# EAGLE design GPS_Tracker_Base_Station (EAGLE 9.7.0)

## Sheet 1 of 2
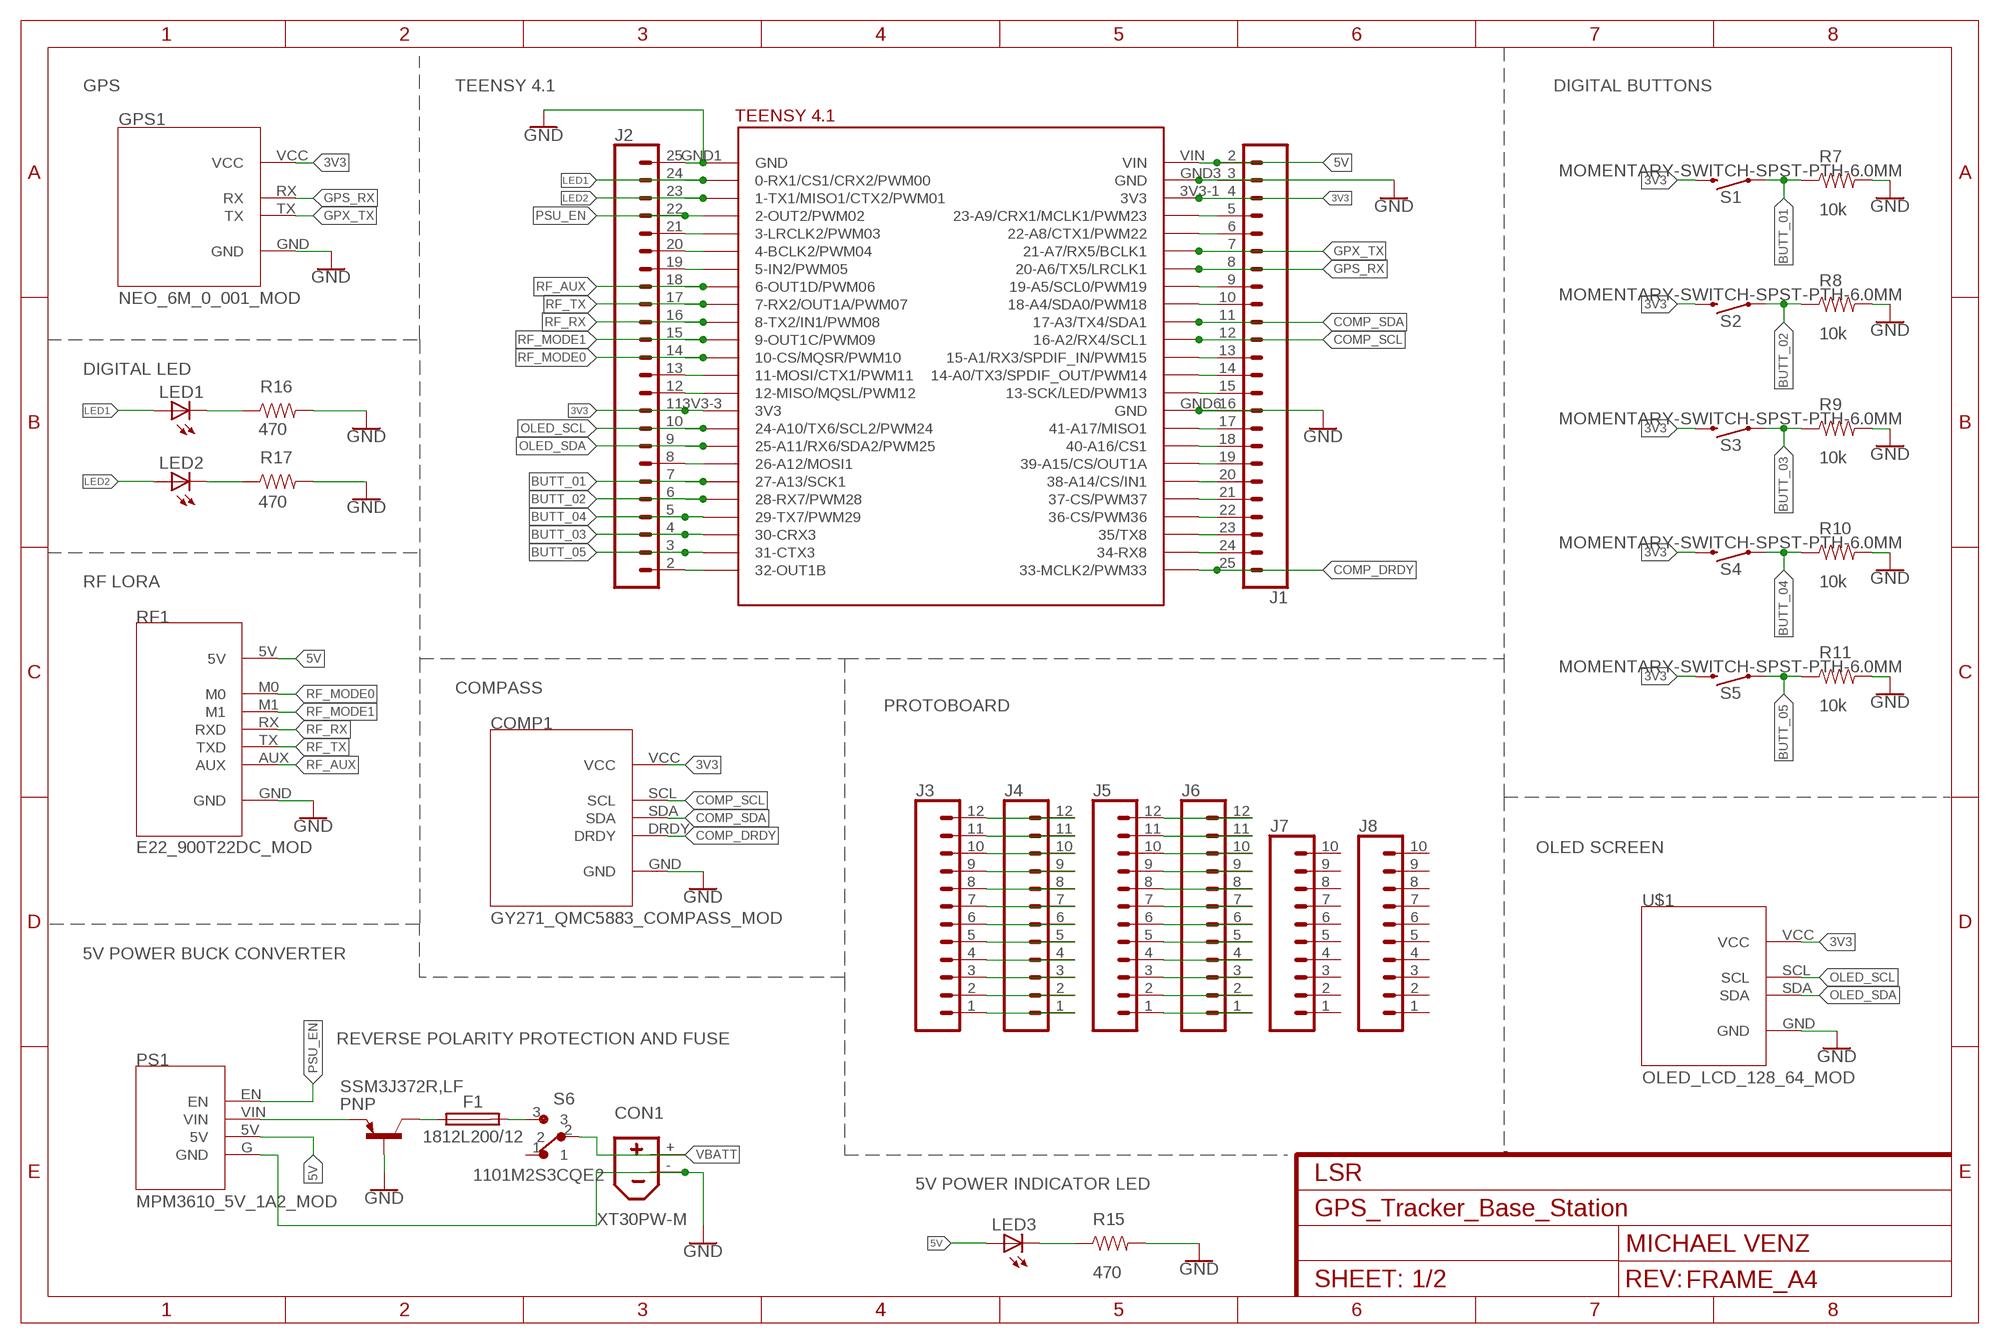
[diagram p0: schematic, sheet 1]

### Parts
COMP1  GY271_QMC5883_COMPASS_MOD  [GY271_QMC5883_COMPASS_MOD_FP]
CON1  XT30PW-M  [XT30PW-PLUG]
F1  1812L200/12  [FUSC4532X125]
GPS1  NEO_6M_0_001_MOD  [NEO_6M_0_001_MOD_FP]
J1  CONN_24  [1X24]
J2  CONN_24  [1X24]
J3  CONN_12NO_SILK  [1X12_NO_SILK]
J4  CONN_12NO_SILK  [1X12_NO_SILK]
J5  CONN_12NO_SILK  [1X12_NO_SILK]
J6  CONN_12NO_SILK  [1X12_NO_SILK]
J7  CONN_10NO_SILK_PTH_FEMALE  [1X10_NO_SILK]
J8  CONN_10NO_SILK_PTH_FEMALE  [1X10_NO_SILK]
LED1  LEDCHIPLED_0805  [CHIPLED_0805]
LED2  LEDCHIPLED_0805  [CHIPLED_0805]
LED3  LEDCHIPLED_0805  [CHIPLED_0805]
PS1  MPM3610_5V_1A2_MOD  [MPM3610_5V_1A2_FP]
R7  10k  0805_RESISTOR  [0805_RESISTOR_FP]
R8  10k  0805_RESISTOR  [0805_RESISTOR_FP]
R9  10k  0805_RESISTOR  [0805_RESISTOR_FP]
R10  10k  0805_RESISTOR  [0805_RESISTOR_FP]
R11  10k  0805_RESISTOR  [0805_RESISTOR_FP]
R15  470  0805_RESISTOR  [0805_RESISTOR_FP]
R16  470  0805_RESISTOR  [0805_RESISTOR_FP]
R17  470  0805_RESISTOR  [0805_RESISTOR_FP]
RF1  E22_900T22DC_MOD  [E22_900T22DC_MOD_FP]
S1  MOMENTARY-SWITCH-SPST-PTH-6.0MM  [TACTILE_SWITCH_PTH_6.0MM]
S2  MOMENTARY-SWITCH-SPST-PTH-6.0MM  [TACTILE_SWITCH_PTH_6.0MM]
S3  MOMENTARY-SWITCH-SPST-PTH-6.0MM  [TACTILE_SWITCH_PTH_6.0MM]
S4  MOMENTARY-SWITCH-SPST-PTH-6.0MM  [TACTILE_SWITCH_PTH_6.0MM]
S5  MOMENTARY-SWITCH-SPST-PTH-6.0MM  [TACTILE_SWITCH_PTH_6.0MM]
S6  1101M2S3CQE2  [SW_1101M2S3CQE2]
SSM3J372R,LF  PNP  PNP_SOT23  [SOT95P237X112-3N]
U$1  OLED_LCD_128_64_MOD  [OLED_LCD_128_64_MOD_FP]
U$3  TEENSY_4_1  [TEENSY_4_1_FP]

### Nets
3V3: COMP1.VCC GPS1.VCC J1.4 J2.11 S1.3 S2.3 S3.3 S4.3 S5.3 U$1.VCC U$3.3V3-1(3V3) U$3.3V3-3(3V3)
5V: J1.2 LED3.A PS1.5V RF1.5V U$3.VIN
BUTT_01: J2.7 R7.1 S1.1 U$3.27-A13/SCK1
BUTT_02: J2.6 R8.1 S2.1 U$3.28-RX7/PWM28
BUTT_03: J2.4 R9.1 S3.1 U$3.30-CRX3
BUTT_04: J2.5 R10.1 S4.1 U$3.29-TX7/PWM29
BUTT_05: J2.3 R11.1 S5.1 U$3.31-CTX3
COMP_DRDY: COMP1.DRDY J1.25 U$3.33-MCLK2/PWM33
COMP_SCL: COMP1.SCL J1.12 U$3.16-A2/RX4/SCL1
COMP_SDA: COMP1.SDA J1.11 U$3.17-A3/TX4/SDA1
GND: COMP1.GND CON1.- GPS1.GND J1.3 J1.16 J2.25 PS1.G(GND) R7.2 R8.2 R9.2 R10.2 R11.2 R15.2 R16.2 R17.2 RF1.GND SSM3J372R,LF.1(B) U$1.GND U$3.GND1(GND) U$3.GND3(GND) U$3.GND6(GND)
GPS_RX: GPS1.RX J1.8 U$3.20-A6/TX5/LRCLK1
GPX_TX: GPS1.TX J1.7 U$3.21-A7/RX5/BCLK1
LED1: J2.24 LED1.A U$3.0-RX1/CS1/CRX2/PWM00
LED2: J2.23 LED2.A U$3.1-TX1/MISO1/CTX2/PWM01
N$1: J1.5 U$3.23-A9/CRX1/MCLK1/PWM23
N$2: J1.6 U$3.22-A8/CTX1/PWM22
N$3: J1.10 U$3.18-A4/SDA0/PWM18
N$4: J1.13 U$3.15-A1/RX3/SPDIF_IN/PWM15
N$5: J3.12 J4.12
N$6: J2.2 U$3.32-OUT1B
N$7: J1.14 U$3.14-A0/TX3/SPDIF_OUT/PWM14
N$8: J1.15 U$3.13-SCK/LED/PWM13
N$9: J1.17 U$3.41-A17/MISO1
N$10: J1.18 U$3.40-A16/CS1
N$11: J1.19 U$3.39-A15/CS/OUT1A
N$12: J1.20 U$3.38-A14/CS/IN1
N$13: J1.21 U$3.37-CS/PWM37
N$14: J1.22 U$3.36-CS/PWM36
N$15: J1.23 U$3.35-TX8(35/TX8)
N$16: J1.24 U$3.34-RX8
N$17: J3.11 J4.11
N$18: J3.10 J4.10
N$19: J1.9 U$3.19-A5/SCL0/PWM19
N$20: J2.21 U$3.3-LRCLK2/PWM03
N$21: J2.20 U$3.4-BCLK2/PWM04
N$22: J2.19 U$3.5-IN2/PWM05
N$23: J2.13 U$3.11-MOSI/CTX1/PWM11
N$24: J2.12 U$3.12-MISO/MQSL/PWM12
N$25: J3.9 J4.9
N$26: J2.8 U$3.26-A12/MOSI1
N$27: J3.8 J4.8
N$29: J3.7 J4.7
N$30: J3.6 J4.6
N$31: J3.5 J4.5
N$33: LED1.C R16.1
N$34: J3.4 J4.4
N$35: J3.3 J4.3
N$36: J3.2 J4.2
N$37: J3.1 J4.1
N$38: J5.12 J6.12
N$39: J5.11 J6.11
N$40: J5.10 J6.10
N$41: J5.9 J6.9
N$42: F1.2 S6.3
N$43: F1.1 SSM3J372R,LF.3(C)
N$44: PS1.VIN SSM3J372R,LF.2(E)
N$45: J5.8 J6.8
N$46: J5.7 J6.7
N$47: J5.6 J6.6
N$48: J5.5 J6.5
N$49: J5.4 J6.4
N$50: J5.3 J6.3
N$51: J5.2 J6.2
N$52: J5.1 J6.1
N$54: LED2.C R17.1
N$55: LED3.C R15.1
OLED_SCL: J2.10 U$1.SCL U$3.24-A10/TX6/SCL2/PWM24
OLED_SDA: J2.9 U$1.SDA U$3.25-A11/RX6/SDA2/PWM25
PSU_EN: J2.22 PS1.EN U$3.2-OUT2/PWM02
RF_AUX: J2.18 RF1.AUX U$3.6-OUT1D/PWM06
RF_MODE0: J2.14 RF1.M0 U$3.10-CS\MQSR/PWM10(10-CS/MQSR/PWM10)
RF_MODE1: J2.15 RF1.M1 U$3.9-OUT1C/PWM09
RF_RX: J2.16 RF1.RX(RXD) U$3.8-TX2/IN1/PWM08
RF_TX: J2.17 RF1.TX(TXD) U$3.7-RX2/OUT1A/PWM07
VBATT: CON1.+ S6.2
Unconnected: J7.1 J7.2 J7.3 J7.4 J7.5 J7.6 J7.7 J7.8 J7.9 J7.10 J8.1 J8.2 J8.3 J8.4 J8.5 J8.6 J8.7 J8.8 J8.9 J8.10 S6.1

### Notes on the sheet
- GPS | TEENSY 4.1 | DIGITAL BUTTONS
- DIGITAL LED
- RF LORA
- COMPASS
- PROTOBOARD
- OLED SCREEN
- 5V POWER BUCK CONVERTER
- REVERSE POLARITY PROTECTION AND FUSE
- 5V POWER INDICATOR LED

## Sheet 2 of 2
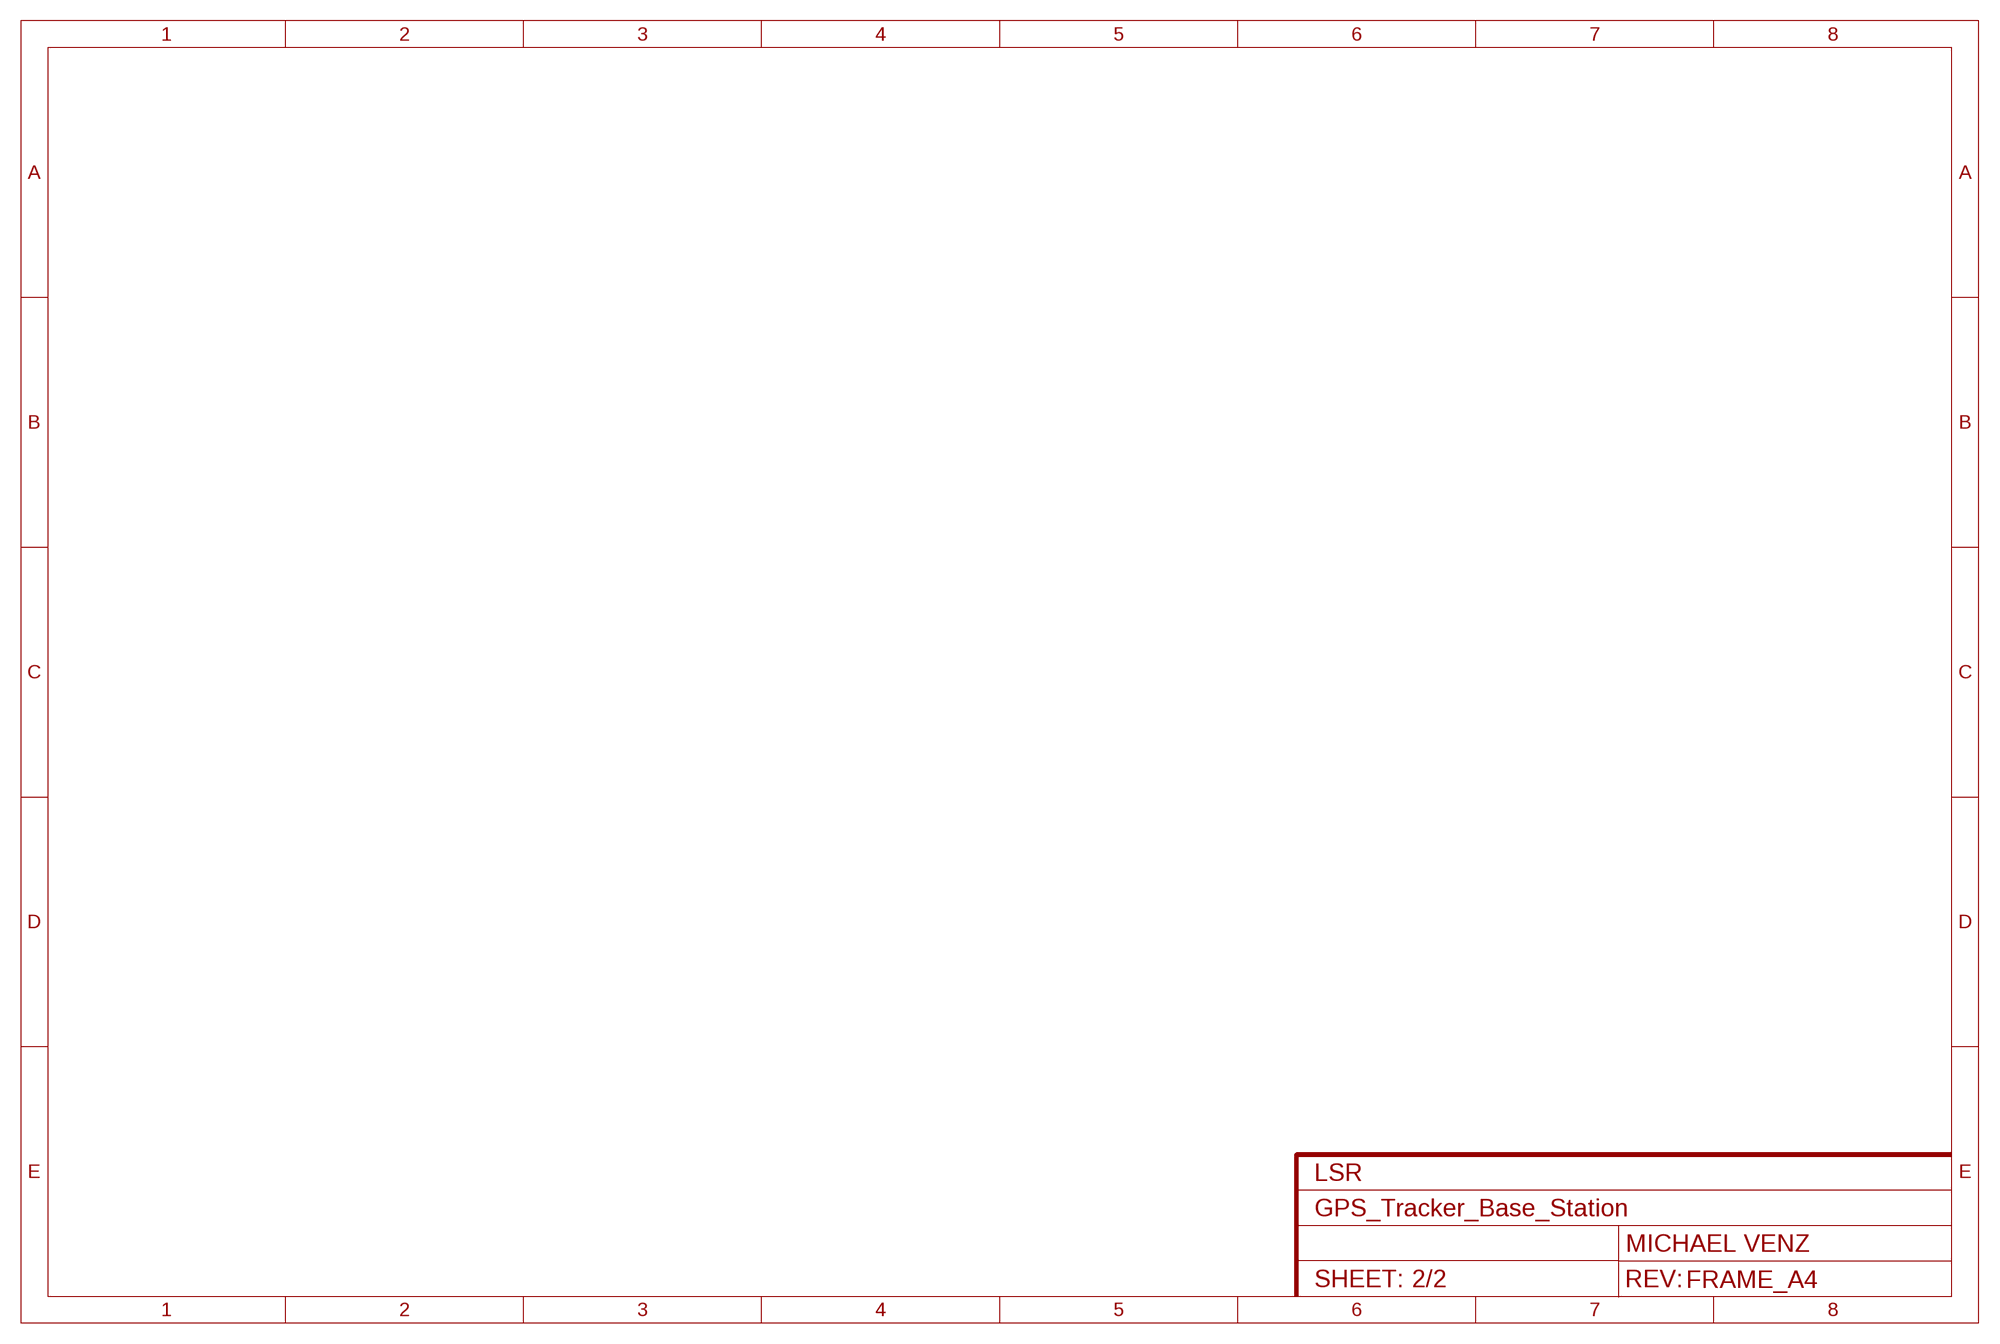
[diagram p1: schematic, sheet 2]

## Library data of the parts
COMP1 = LSR_Modules:GY271_QMC5883_COMPASS_MOD
CON1 = LSR_Connectors:XT30: AMASS XT30 connector Store in Japan AMASS XT30 connector <https://szc.jp/ams-xt30>
F1 = Fuse:1812L: 1812L Series PTC provides surface mount overcurrent protection for applications where resettable protection is desired. Datasheet <https://www.littelfuse.com/~/media/electronics/datasheets/resettable_ptcs/littelfuse_ptc_1812l_datasheet.pdf.pdf>; CATEGORY: FUSE; DESCRIPTION: Resettable PTCs; MANUFACTURER: Littlefuse; MPN: 1812L200/12; OPERATING_TEMPERATURE: -40°C to +85°C; PART_STATUS: ACTIVE; ROHS_COMPLIANCE: RoHS Compliant; SERIES: 1812L; SUBCATEGORY: Resettable; TYPE: PTC
GPS1 = LSR_Modules:NEO_6M_0_001_MOD
J1 J2 = SparkFun-Connectors:CONN_24: Multi connection point. Often used as Generic Header-pin footprint for 0.1 inch spaced/style header connections On any of the 0.1 inch spaced packages, you can populate with these: Break Away Headers - Straight <https://www.sparkfun.com/products/116> (PRT-00116) Break Away Male Headers - Right Angle <https://www.sparkfun.com/products/553> (PRT-00553) Female Headers <https://www.sparkfun.com/products/115> (PRT-00115) Break Away Headers - Machine Pin <https://www.sparkfun.com/products/117> (PRT-00117) Break Away Female Headers - Swiss Machine Pin <https://www.sparkfun.com/products/743> (PRT-00743) For SCREWTERMINALS and SPRING TERMINALS visit here: Screw Terimnals on SparkFun.com <https://www.sparkfun.com/search/results?term=Screw+Terminals> (5mm/3.5mm/2.54mm spacing) This device is also useful as a general connection point to wire up your design to another part of your project. Our various solder wires solder well into these plated through hole pads. Hook-Up Wire - Assortment (Stranded, 22 AWG) <https://www.sparkfun.com/products/11375> (PRT-11375) Hook-Up Wire - Assortment (Solid Core, 22 AWG) <https://www.sparkfun.com/products/11367> (PRT-11367) View the entire wire category on our website here <https://www.sparkfun.com/categories/141> Special notes: Molex polarized connector foot print use with SKU : PRT-08231 with associated crimp pins and housings. 1MM SMD Version SKU: PRT-10208 NOTES ON THE VARIANTS LOCK and LOCK_LONGPADS... This footprint was designed to help hold the alignment of a through-hole component (i.e. 6-pin header) while soldering it into place. You may notice that each hole has been shifted either up or down by 0.005 of an inch from it's more standard position (which is a perfectly straight line). This slight alteration caused the pins (the squares in the middle) to touch the edges of the holes. Because they are alternating, it causes a "brace" to hold the component in place. 0.005 has proven to be the perfect amount of "off-center" position when using our standard breakaway headers. Although looks a little odd when you look at the bare footprint, once you have a header in there, the alteration is very hard to notice. Also,if you push a header all the way into place, it is covered up entirely on the bottom side.
J3-J6 = SparkFun-Connectors:CONN_12: Multi connection point. Often used as Generic Header-pin footprint for 0.1 inch spaced/style header connections On any of the 0.1 inch spaced packages, you can populate with these: Break Away Headers - Straight <https://www.sparkfun.com/products/116> (PRT-00116) Break Away Male Headers - Right Angle <https://www.sparkfun.com/products/553> (PRT-00553) Female Headers <https://www.sparkfun.com/products/115> (PRT-00115) Break Away Headers - Machine Pin <https://www.sparkfun.com/products/117> (PRT-00117) Break Away Female Headers - Swiss Machine Pin <https://www.sparkfun.com/products/743> (PRT-00743) For SCREWTERMINALS and SPRING TERMINALS visit here: Screw Terimnals on SparkFun.com <https://www.sparkfun.com/search/results?term=Screw+Terminals> (5mm/3.5mm/2.54mm spacing) This device is also useful as a general connection point to wire up your design to another part of your project. Our various solder wires solder well into these plated through hole pads. Hook-Up Wire - Assortment (Stranded, 22 AWG) <https://www.sparkfun.com/products/11375> (PRT-11375) Hook-Up Wire - Assortment (Solid Core, 22 AWG) <https://www.sparkfun.com/products/11367> (PRT-11367) View the entire wire category on our website here <https://www.sparkfun.com/categories/141> Special notes: Molex polarized connector foot print use with SKU : PRT-08231 with associated crimp pins and housings. 1MM SMD Version SKU: PRT-10208 NOTES ON THE VARIANTS LOCK and LOCK_LONGPADS... This footprint was designed to help hold the alignment of a through-hole component (i.e. 6-pin header) while soldering it into place. You may notice that each hole has been shifted either up or down by 0.005 of an inch from it's more standard position (which is a perfectly straight line). This slight alteration caused the pins (the squares in the middle) to touch the edges of the holes. Because they are alternating, it causes a "brace" to hold the component in place. 0.005 has proven to be the perfect amount of "off-center" position when using our standard breakaway headers. Although looks a little odd when you look at the bare footprint, once you have a header in there, the alteration is very hard to notice. Also,if you push a header all the way into place, it is covered up entirely on the bottom side.
J7 J8 = SparkFun-Connectors:CONN_10: Multi connection point. Often used as Generic Header-pin footprint for 0.1 inch spaced/style header connections On any of the 0.1 inch spaced packages, you can populate with these: Break Away Headers - Straight <https://www.sparkfun.com/products/116> (PRT-00116) Break Away Male Headers - Right Angle <https://www.sparkfun.com/products/553> (PRT-00553) Female Headers <https://www.sparkfun.com/products/115> (PRT-00115) Break Away Headers - Machine Pin <https://www.sparkfun.com/products/117> (PRT-00117) Break Away Female Headers - Swiss Machine Pin <https://www.sparkfun.com/products/743> (PRT-00743) Arduino Stackable Header - 10 Pin <https://www.sparkfun.com/products/11376> (PRT-11376) For SCREWTERMINALS and SPRING TERMINALS visit here: Screw Terimnals on SparkFun.com <https://www.sparkfun.com/search/results?term=Screw+Terminals> (5mm/3.5mm/2.54mm spacing) This device is also useful as a general connection point to wire up your design to another part of your project. Our various solder wires solder well into these plated through hole pads. Hook-Up Wire - Assortment (Stranded, 22 AWG) <https://www.sparkfun.com/products/11375> (PRT-11375) Hook-Up Wire - Assortment (Solid Core, 22 AWG) <https://www.sparkfun.com/products/11367> (PRT-11367) View the entire wire category on our website here <https://www.sparkfun.com/categories/141> Special notes: Molex polarized connector foot print use with SKU : PRT-08231 with associated crimp pins and housings. 1MM SMD Version SKU: PRT-10208 NOTES ON THE VARIANTS LOCK and LOCK_LONGPADS... This footprint was designed to help hold the alignment of a through-hole component (i.e. 6-pin header) while soldering it into place. You may notice that each hole has been shifted either up or down by 0.005 of an inch from it's more standard position (which is a perfectly straight line). This slight alteration caused the pins (the squares in the middle) to touch the edges of the holes. Because they are alternating, it causes a "brace" to hold the component in place. 0.005 has proven to be the perfect amount of "off-center" position when using our standard breakaway headers. Although looks a little odd when you look at the bare footprint, once you have a header in there, the alteration is very hard to notice. Also,if you push a header all the way into place, it is covered up entirely on the bottom side.; PROD_ID: CONN-11563
LED1-LED3 = adafruit:LED: LED OSRAM: - CHIPLED LG R971, LG N971, LY N971, LG Q971, LY Q971, LO R971, LY R971 LH N974, LH R974 LS Q976, LO Q976, LY Q976 LO Q996 - Hyper CHIPLED LW Q18S LB Q993, LB Q99A, LB R99A - SideLED LS A670, LO A670, LY A670, LG A670, LP A670 LB A673, LV A673, LT A673, LW A673 LH A674 LY A675 LS A676, LA A676, LO A676, LY A676, LW A676 LS A679, LY A679, LG A679 - Hyper Micro SIDELED® LS Y876, LA Y876, LO Y876, LY Y876 LT Y87S - SmartLED LW L88C, LW L88S LB L89C, LB L89S, LG L890 LS L89K, LO L89K, LY L89K LS L896, LA L896, LO L896, LY L896 - TOPLED LS T670, LO T670, LY T670, LG T670, LP T670 LSG T670, LSP T670, LSY T670, LOP T670, LYG T670 LG T671, LOG T671, LSG T671 LB T673, LV T673, LT T673, LW T673 LH T674 LS T676, LA T676, LO T676, LY T676, LB T676, LH T676, LSB T676, LW T676 LB T67C, LV T67C, LT T67C, LS T67K, LO T67K, LY T67K, LW E67C LS E67B, LA E67B, LO E67B, LY E67B, LB E67C, LV E67C, LT E67C LW T67C LS T679, LY T679, LG T679 LS T770, LO T770, LY T770, LG T770, LP T770 LB T773, LV T773, LT T773, LW T773 LH T774 LS E675, LA E675, LY E675, LS T675 LS T776, LA T776, LO T776, LY T776, LB T776 LHGB T686 LT T68C, LB T68C - Hyper Mini TOPLED® LB M676 - Mini TOPLED Santana® LG M470 LS M47K, LO M47K, LY M47K Source: http://www.osram.convergy.de/
PS1 = LSR_PSU:MPM3610_5V_1A2_MOD
R7-R11 = LSR_Generic_Parts:0805_RESISTOR
R15-R17 = LSR_Generic_Parts:0805_RESISTOR; VALUE: 10k
RF1 = LSR_Modules:E22_900T22DC_MOD
S1-S5 = LSR_Switches:MOMENTARY-SWITCH-SPST: Momentary Switch (Pushbutton) - SPST Normally-open (NO) SPST momentary switches (buttons, pushbuttons). Variants PTH-12MM - 12mm square, through-hole Momentary Pushbutton Switch - 12mm Square <https://www.sparkfun.com/products/9190> (COM-09190) PTH-6.0MM, PTH-6.0MM-KIT - 6.0mm square, through-hole Mini Pushbutton Switch <https://www.sparkfun.com/products/97> (COM-00097) KIT package intended for soldering kit's - only one side of pads' copper is exposed. PTH-RIGHT-ANGLE-KIT - Right-angle, through-hole Right Angle Tactile Button <https://www.sparkfun.com/products/10791> - Used on SparkFun BigTime Watch Kit <https://www.sparkfun.com/products/11734> SMD-12MM - 12mm square, surface-mount Tactile Button - SMD (12mm) <https://www.sparkfun.com/products/12993> (COM-12993) Used on SparkFun PicoBoard <https://www.sparkfun.com/products/11888> SMD-4.5MM - 4.5mm Square Trackball Switch Used on SparkFun Blackberry Trackballer Breakout <https://www.sparkfun.com/products/13169> SMD-4.6MMX2.8MM - 4.60mm x 2.80mm, surface mount Used on SparkFun SAMD21 Mini Breakout <https://www.sparkfun.com/products/13664> SMD-5.2MM, SMD-5.2-REDUNDANT - 5.2mm square, surface-mount Mini Pushbutton Switch - SMD <https://www.sparkfun.com/products/8720> (COM-08720) Used on Arduino Pro Mini <https://www.sparkfun.com/products/11114> REDUNDANT package connects both switch circuits together SMD-6.0X3.5MM - 6.0 x 3.5mm, surface mount Momentary Reset Switch SMD <https://www.sparkfun.com/products/8229> (COM-08229) SMD-6.2MM-TALL - 6.2mm square, surface mount Tactile Button - SMD (6mm) <https://www.sparkfun.com/products/12992> Used on SparkFun Digital Sandbox <https://www.sparkfun.com/products/12651> SMD-RIGHT-ANGLE - Right-angle, surface mount Used on SparkFun Block for Intel® Edison - Arduino <https://www.sparkfun.com/products/13036>; PROD_ID: SWCH-08441; SF_SKU: COM-00097
S6 = LSR_Switches:1101M2S3CQE2: Switch, Slide, PC Terminal, SPST, ON-NONE-OFF, 0.4VA MAX@120VAC OR VDC MAX; DESCRIPTION: Switch, Slide, PC Terminal, SPST, ON-NONE-OFF, 0.4VA MAX@120VAC OR VDC MAX; DIGI-KEY_PART_NUMBER: CKN5001-ND; DIGI-KEY_PURCHASE_URL: https://www.digikey.com.au/product-detail/en/c-k/1101M2S3CQE2/CKN5001-ND/67042?utm_source=snapeda&utm_medium=aggregator&utm_campaign=symbol; MF: C&K; MP: 1101M2S3CQE2; PACKAGE: None
SSM3J372R,LF = Transistor:PNP: PNP - Generic; CATEGORY: Transistor; SUB-CATEGORY: BJT; TYPE: PNP
U$1 = LSR_Modules:OLED_LCD_128_64_MOD
U$3 = LSR_Microcontrollers:TEENSY_4_1

## Board
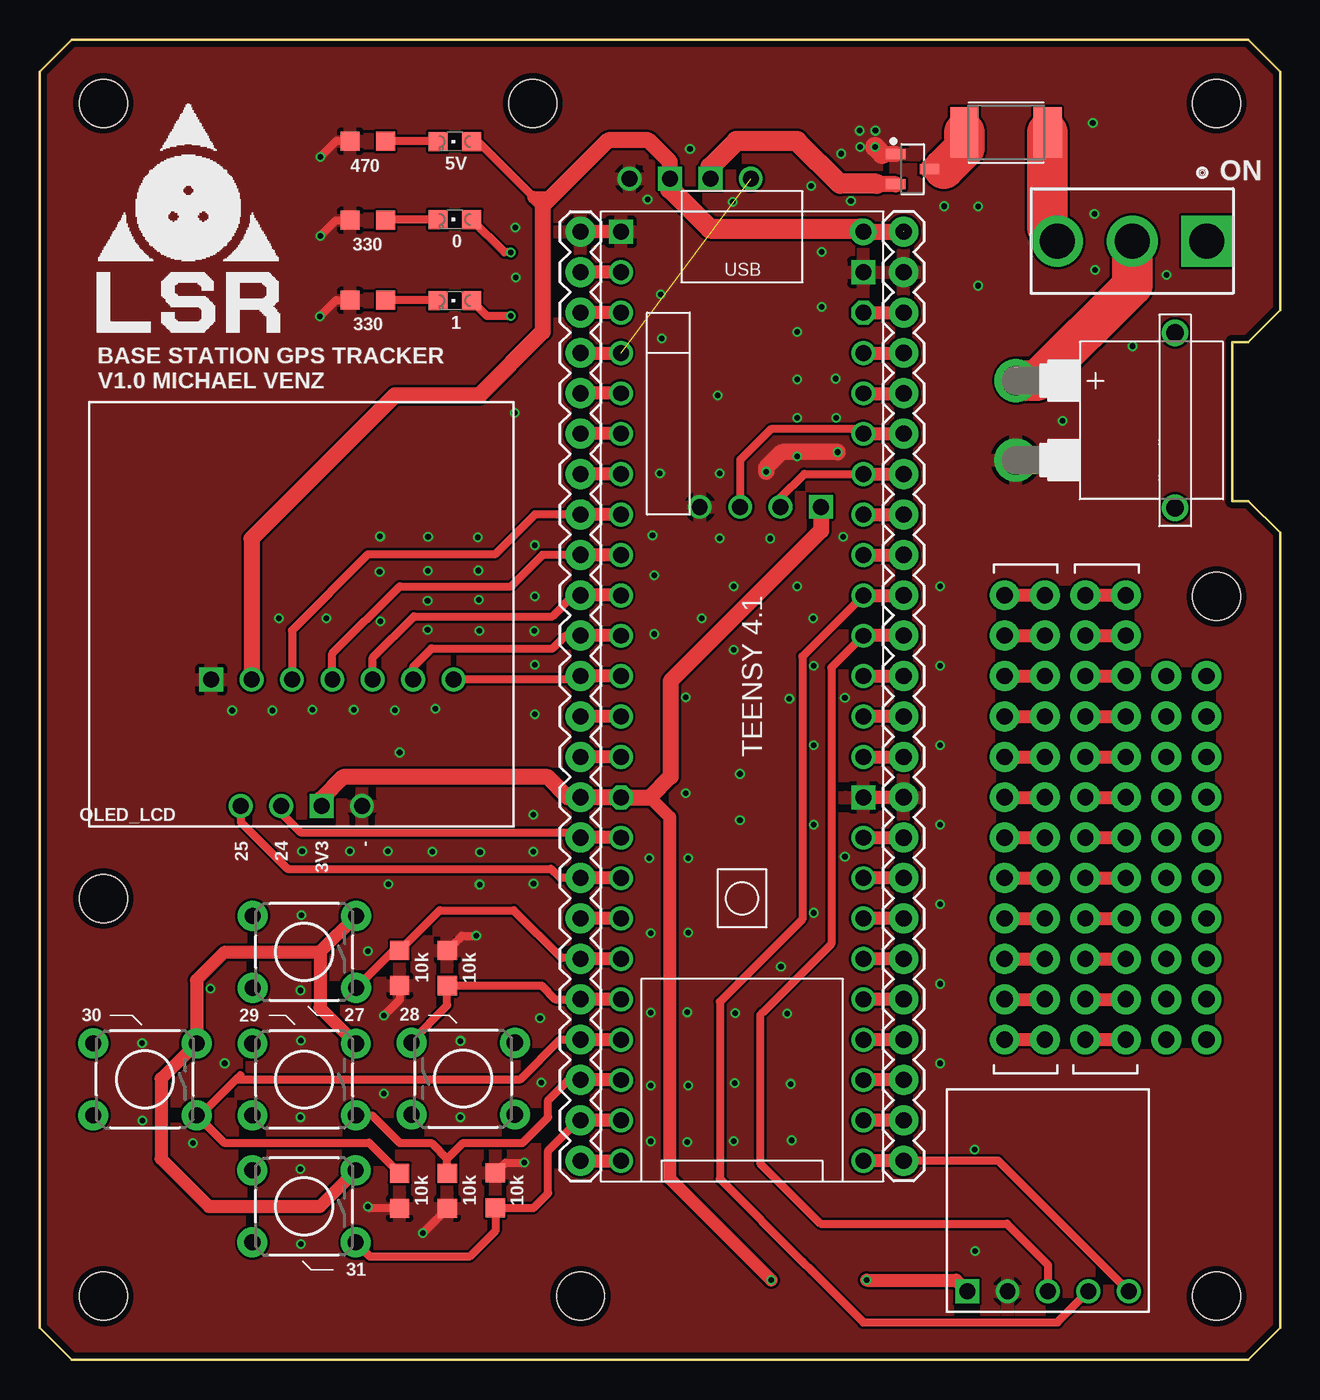
[diagram p2: board, top side]
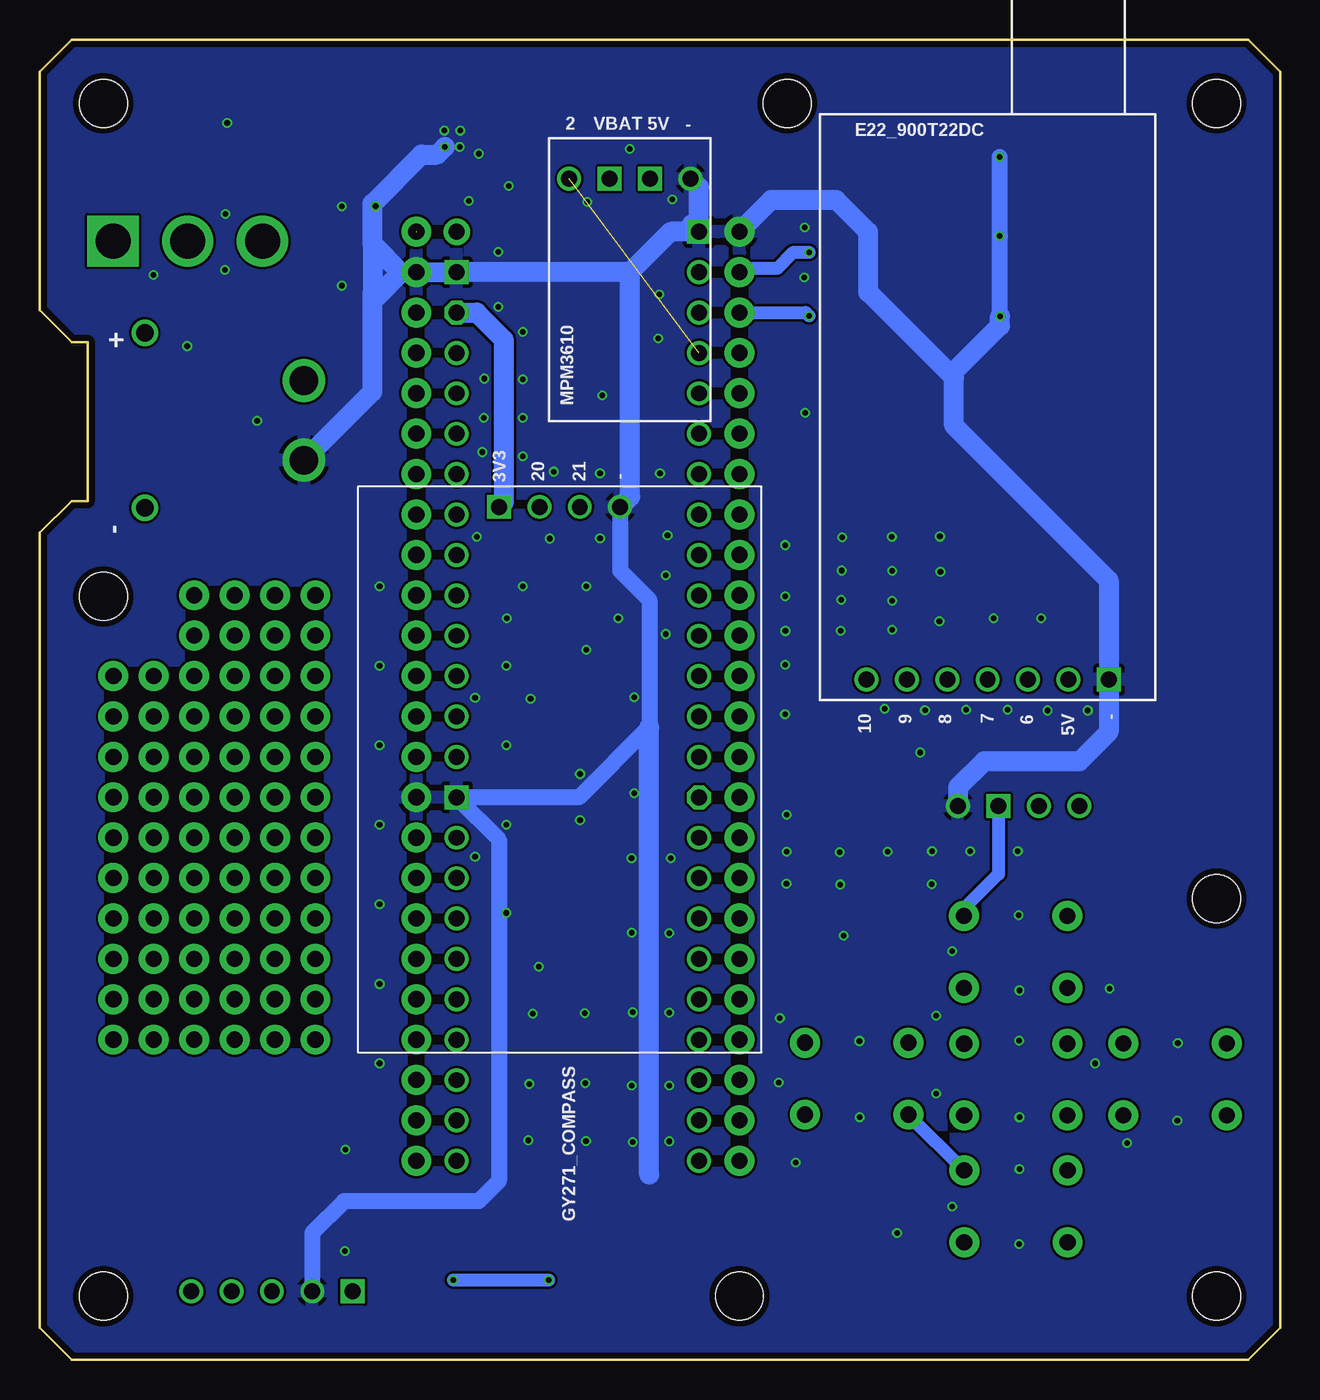
[diagram p3: board, bottom side, seen from below]

Size 78 x 83 mm. Coordinates in mm from the lower left corner, seen from the top.
Outline: 0,2 2,0 76,0 78,2 78,52 76,54 75,54 75,64 76,64 78,66 78,81 76,83 2,83 0,81 0,2
Copper layers (1*16): Top 0.035559375mm / dielectric 1.6mm / Bottom 0.035559375mm
Design rules "oshpark-2layer": minimum track width 6mil, minimum drill 10mil, track to track 6mil, track to pad 6mil, pad to pad 6mil, via to via 6mil, smd to smd 6mil, copper to edge 15mil, drill to drill 6mil, minimum pad ring 5mil, minimum via ring 5mil, stop-mask expansion 2.5mil, vias tented up to drill 0mil, thermal gap 10mil
Holes 3 mm at 4,4 4,79 34,4 74,79 74,4 4,29 31,79 74,48

### Footprints (pad centres in the part's own frame; a part is rotated, then mirrored left to right if it is on the bottom)
GY271_QMC5883_COMPASS_MOD_FP = drill 1: DRDY -6.35,-5.08; GND -6.35,2.54; SCL -6.35,0; SDA -6.35,-2.54 | drill 1 square: VCC -6.35,5.08
XT30PW-PLUG = drill 1.8: + -2.5,0; - 2.5,0 | drill 1.1: P$3 -5.5,10; P$4 5.5,10
FUSC4532X125 = smd 1.78 x 3.15: 1 -2.615,0; 2 2.615,0
NEO_6M_0_001_MOD_FP = drill 1: GND -15.24,3.81; RX -15.24,-1.27; TX -15.24,1.27 | drill 1 square: VCC -15.24,-3.81
1X24 = drill 1.016 pad 1.88: 2 -26.67,0; 3 -24.13,0; 4 -21.59,0; 5 -19.05,0; 6 -16.51,0; 7 -13.97,0; 8 -11.43,0; 9 -8.89,0; 10 -6.35,0; 11 -3.81,0; 12 -1.27,0; 13 1.27,0; 14 3.81,0; 15 6.35,0; 16 8.89,0; 17 11.43,0; 18 13.97,0; 19 16.51,0; 20 19.05,0; 21 21.59,0; 22 24.13,0; 23 26.67,0; 24 29.21,0; 25 31.75,0
1X12_NO_SILK = drill 1.016 pad 1.88: 1 0,0; 2 2.54,0; 3 5.08,0; 4 7.62,0; 5 10.16,0; 6 12.7,0; 7 15.24,0; 8 17.78,0; 9 20.32,0; 10 22.86,0; 11 25.4,0; 12 27.94,0
1X10_NO_SILK = drill 1.016 pad 1.88: 1 0,0; 2 2.54,0; 3 5.08,0; 4 7.62,0; 5 10.16,0; 6 12.7,0; 7 15.24,0; 8 17.78,0; 9 20.32,0; 10 22.86,0
CHIPLED_0805 = smd 1.2 x 1.2: A 0,-1.05; C 0,1.05
MPM3610_5V_1A2_FP = drill 1 square: 5V -6.35,1.27; VIN -6.35,-1.27 | drill 1: EN -6.35,-3.81; G -6.35,3.81
0805_RESISTOR_FP = smd 1.2 x 1.2: 1 -1.109,0; 2 1.101,0
E22_900T22DC_MOD_FP = drill 1: 5V -17.78,-6.35; AUX -17.78,-3.81; M0 -17.78,6.35; M1 -17.78,3.81; RX -17.78,1.27; TX -17.78,-1.27 | drill 1 square: GND -17.78,-8.89
TACTILE_SWITCH_PTH_6.0MM = drill 1.016 pad 1.88: 1 -3.251,2.261; 2 3.251,2.261; 3 -3.251,-2.261; 4 3.251,-2.261
SW_1101M2S3CQE2 = drill 2.2 pad 3 square: 1 0,4.7 | drill 2.2 pad 3: 2 0,0; 3 0,-4.7
SOT95P237X112-3N = smd 1.224 x 0.625: 1 -1.064,0.95; 2 -1.064,-0.95; 3 1.064,0
OLED_LCD_128_64_MOD_FP = drill 1: GND -12.7,-3.81; SCL -12.7,1.27; SDA -12.7,3.81 | drill 1 square: VCC -12.7,-1.27
TEENSY_4_1_FP = drill 1: 0-RX1/CS1/CRX2/PWM00 1.27,57.15; 1-TX1/MISO1/CTX2/PWM01 1.27,54.61; 2-OUT2/PWM02 1.27,52.07; 3-LRCLK2/PWM03 1.27,49.53; 4-BCLK2/PWM04 1.27,46.99; 5-IN2/PWM05 1.27,44.45; 6-OUT1D/PWM06 1.27,41.91; 7-RX2/OUT1A/PWM07 1.27,39.37; 8-TX2/IN1/PWM08 1.27,36.83; 9-OUT1C/PWM09 1.27,34.29; 10-CS\MQSR/PWM10 1.27,31.75; 11-MOSI/CTX1/PWM11 1.27,29.21; 12-MISO/MQSL/PWM12 1.27,26.67; 13-SCK/LED/PWM13 16.51,26.67; 14-A0/TX3/SPDIF_OUT/PWM14 16.51,29.21; 15-A1/RX3/SPDIF_IN/PWM15 16.51,31.75; 16-A2/RX4/SCL1 16.51,34.29; 17-A3/TX4/SDA1 16.51,36.83; 18-A4/SDA0/PWM18 16.51,39.37; 19-A5/SCL0/PWM19 16.51,41.91; 20-A6/TX5/LRCLK1 16.51,44.45; 21-A7/RX5/BCLK1 16.51,46.99; 22-A8/CTX1/PWM22 16.51,49.53; 23-A9/CRX1/MCLK1/PWM23 16.51,52.07; 24-A10/TX6/SCL2/PWM24 1.27,21.59; 25-A11/RX6/SDA2/PWM25 1.27,19.05; 26-A12/MOSI1 1.27,16.51; 27-A13/SCK1 1.27,13.97; 28-RX7/PWM28 1.27,11.43; 29-TX7/PWM29 1.27,8.89; 30-CRX3 1.27,6.35; 31-CTX3 1.27,3.81; 32-OUT1B 1.27,1.27; 33-MCLK2/PWM33 16.51,1.27; 34-RX8 16.51,3.81; 35-TX8 16.51,6.35; 36-CS/PWM36 16.51,8.89; 37-CS/PWM37 16.51,11.43; 38-A14/CS/IN1 16.51,13.97; 39-A15/CS/OUT1A 16.51,16.51; 40-A16/CS1 16.51,19.05; 41-A17/MISO1 16.51,21.59 | drill 1 octagon: 3V3-1 1.27,24.13; 3V3-3 16.51,54.61 | drill 1 square: GND1 1.27,59.69; GND3 16.51,24.13; GND6 16.51,57.15 | drill 1 pad 1.676: VIN 16.51,59.69

### Placement (x,y rotation side)
COMP1  63.4,10.64 90 top
CON1  61.39,59.07 270 top
F1  60.76,77.17 0 top
GPS1  45.31,38.39 270 bottom
J1  54.32,44.26 270 top
J2  34,39.18 90 top
J3  60.67,20.13 90 top
J4  63.21,20.13 90 top
J5  65.75,20.13 90 top
J6  68.29,20.13 90 top
J7  70.83,20.13 90 top
J8  73.37,20.13 90 top
LED1  26.1,71.7 90 top
LED2  26.1,66.6 90 top
LED3  26.1,76.6 90 top
PS1  40.9,67.92 270 bottom
R7  22.64,24.63 270 top
R8  25.63,24.63 90 top
R9  25.63,10.62 270 top
R10  22.63,10.62 270 top
R11  28.65,10.65 90 top
R15  20.63,76.62 180 top
R16  20.63,71.64 180 top
R17  20.63,66.62 180 top
RF1  19.67,60.54 90 bottom
S1  16.63,25.64 180 top
S2  26.62,17.68 0 top
S3  16.63,17.62 180 top
S4  6.61,17.64 180 top
S5  16.62,9.64 180 top
S6  68.7,70.34 270 top
SSM3J372R,LF  54.89,74.86 0 top
U$1  16.45,47.51 90 top
U$2  [LSR_LOGO_TEXT_200PX_FP]  3.63,64.63 0 top
U$3  35.27,11.23 0 top

### Tracks (layer width: path | path; a pad name or v marks a point on that pad's centre or on a via)
3V3  (via drill 0.35)
  Top 0.813: J2.11 33.2,35.37 | U$3.3V3-3 J1.4 | 17.63,25.63 11.63,25.63 9.86,23.87 S4.3 7.63,17.66 7.63,12.63 10.63,9.63 17.63,9.63 19.87,11.88 S5.3 | 17.63,25.63 19.88,27.89 S1.3 | 17.63,25.63 17.63,22.13 S3.3 | 38.36,35.36 39.6,34.12 39.6,11.4 v46,5 | v52,5 57.61,5 COMP1.VCC
  Top 1.016: J2.11 U$3.3V3-1 38.36,35.36 39.67,36.67 39.67,42.67 49.12,52.13 GPS1.VCC | 33.2,35.37 31.94,36.63 19.08,36.63 17.72,35.27 U$1.VCC
  Bottom 0.813: U$1.VCC 17.72,30.54 19.88,28.38 S1.3 | S5.3 S2.3 | v46,5 v52,5
  Bottom 1.27: U$3.3V3-3 50.53,65.84 48.83,64.14 48.83,53.92 GPS1.VCC
5V  (1 unrouted)
  Top 0.508: LED3.A 27.56,76.6 31.08,73.08
  Top 0.813: 31.63,72.53 31.08,73.08 32.13,73.08 32.53,73.47
  Top 1.016: PS1.5V 39.63,75.33 38.27,76.68 35.74,76.68 32.53,73.47 31.63,72.58 31.63,72.53 31.63,64.63 27.63,60.63 22.32,60.63 13.32,51.63 RF1.5V | U$3.VIN 54.34,70.92
  Top 1.27: PS1.5V 39.63,73.63 42.14,71.12 51.58,71.12 U$3.VIN
BUTT_01
  Top 0.508: S1.1 22.24,25.74 R7.1 25.16,28.26 29.81,28.26 32.82,25.26 33.95,25.26 J2.7
  Top 0.813: U$3.27-A13/SCK1 J2.7
BUTT_02
  Top 0.508: J2.6 32.41,22.67 31.56,23.52 R8.1 25.63,22.29 23.37,20.03 S2.1
  Top 0.813: U$3.28-RX7/PWM28 J2.6
BUTT_03
  Top 0.508: S3.1 20.91,15.36 22.63,13.63 24.63,13.63 25.63,12.63 | R9.1 25.63,12.63 | 25.63,12.63 26.63,13.63 30.36,13.63 31.97,15.24 31.97,16.32 33.24,17.59 J2.4
  Top 0.813: U$3.30-CRX3 J2.4
BUTT_04
  Top 0.508: R10.1 20.71,13.65 11.59,13.65 S4.1 10.1,15.38 12.36,17.64 | 12.62,17.89 12.36,17.64 | 12.36,17.64 30.24,17.64 32.73,20.13 J2.5
  Top 0.813: J2.5 U$3.29-TX7/PWM29
BUTT_05
  Top 0.508: S5.1 20.77,6.48 27.02,6.48 28.65,8.11 R11.1 31.04,9.54 31.97,10.48 31.97,13.14 33.87,15.05 J2.3
  Top 0.813: U$3.31-CTX3 J2.3
COMP_DRDY
  Top 0.508: COMP1.DRDY 60.27,12.51 J1.25
  Top 0.813: J1.25 U$3.33-MCLK2/PWM33
COMP_SCL
  Top 0.305: 45.44,21.82 45.29,21.67
  Top 0.508: 45.29,21.67 45.29,12.35 49.09,8.55 60.82,8.55 63.4,5.97 COMP1.SCL | 45.44,21.82 49.77,26.15 49.77,43.52 U$3.16-A2/RX4/SCL1
  Top 0.813: J1.12 U$3.16-A2/RX4/SCL1
COMP_SDA
  Top 0.508: U$3.17-A3/TX4/SDA1 47.95,44.23 47.95,27.69 42.76,22.5 42.76,11.37 47.97,6.16 48.54,5.59 51.78,2.35 64,2.35 COMP1.SDA
  Top 0.813: U$3.17-A3/TX4/SDA1 J1.11
GND  (via drill 0.35)
  Top 0.508: v17.64,75.62 18.67,76.65 19.5,76.65 R15.2 | v17.64,70.65 18.63,71.64 R16.2 | v17.62,65.61 18.64,66.63 19.52,66.63 R17.2 | R11.2 29.28,12.39 v30.46,12.39 | R8.2 26.55,26.65 v27.44,26.65 | R10.2 20.74,9.52 v20.63,9.63 | R7.2 22.63,22.64 v21.63,21.63 | v24.1,7.97 25.63,9.5 R9.2
  Top 0.813: U$3.GND1 J2.25 | U$3.GND3 J1.16
  Top 1.016: v45.67,55.84 45.67,56.09 46.64,57.06 50.17,57.06 v50.18,57.07 | SSM3J372R,LF.1 52.98,75.81
  Top 1.27: 52.98,75.81 v52.53,76.26
  Bottom 0.813: U$3.GND3 51.36,35.36
  Bottom 1.016: GPS1.GND 41.5,49.62 39.66,47.78 39.66,39.8 39.68,39.78 44.1,35.36 U$3.GND3 49.13,32.71 49.13,11.24 50.4,9.97 58.87,9.97 60.86,7.98 COMP1.GND | 37.09,71.47 U$3.GND1 | v17.62,65.61 17.62,70.63 v17.64,70.65 v17.64,75.62
  Bottom 1.27: PS1.G 36.54,73.72 U$3.GND1 38.34,70.92 40.88,68.38 | 40.88,68.38 U$3.GND6 J1.3 55.31,68.39 | 40.88,68.38 40.88,54.25 GPS1.GND | U$1.GND 20.26,36 18.63,37.63 12.63,37.63 10.78,39.48 RF1.GND 10.78,49.01 20.52,58.74 20.52,62.12 17.62,65.02 v17.62,65.61 | 20.52,61.75 25.9,67.12 25.9,70.9 27.91,72.91 32.02,72.91 J2.25 | 57.09,70.17 55.31,68.39 | 55.31,68.39 55.26,68.34 55.3,68.34 56.82,66.82 57.09,67.09 | v52.53,76.26 53.01,75.78 54.01,75.78 57.09,72.71 57.09,70.17 | 57.09,70.17 57.09,67.09 | CON1.- 57.09,60.87 57.09,67.09 | 39.68,11.65 39.68,39.78
  other vias: 18.03,46.63 24.39,45.89 15.03,46.63 16.5,31.98 21.9,31.98 38.53,51.83 38.63,49.33 44.03,36.83 44.03,33.93 43.65,13.75 38.43,13.73 38.43,17.23 38.43,21.83 38.43,26.83 38.33,31.53 50.53,51.73 45.93,51.63 40.78,26.86 40.79,31.53 31.13,43.69 31.11,45.82 31.12,51.22 31.12,48.01 16.41,20.06 6.44,19.91 16.4,11.99 16.45,27.95 26.45,15.24 16.4,15.24 16.42,7.26 6.47,15.03 16.4,23.22 12.1,40.82 14.62,40.82 17.14,40.87 19.74,40.87 22.34,40.84 24.88,40.92 42.77,51.64 42.77,55.73 39,55.74 29.94,68.05 29.87,59.53 29.9,71.2 56.63,43.63 56.63,38.63 56.63,33.63 56.63,28.63 56.63,23.63 56.63,18.63 56.63,48.63 58.81,6.84 50.63,41.63 50.63,31.63 48.63,46.63 43.63,44.63 40.63,35.63 38.63,45.63 31.14,40.58 42.63,60.63 39.11,64.23 39.04,66.99 43.58,72.79 47.14,41.55 31.46,21.48 31.54,17.43 40.89,76.13 56.88,72.53 20.63,25.69 26.46,20.05 31.05,29.93 31.03,31.94 19.5,31.98 31.03,34.26 22.63,38.19 43.7,17.38 43.74,21.79 46.61,24.71 47.01,21.76 47.22,17.34 47.28,13.79 27.63,45.83 27.61,47.77 27.58,49.62 24.4,49.61 24.39,47.73 66.32,72.05 50.39,75.83 38.22,72.95 49.17,69.66 49.16,66.2 47.63,61.63 47.63,64.63 50.05,61.69 47.63,56.79 21.37,49.55 27.69,31.91 24.69,31.94 27.66,29.88 21.91,29.9 43.63,48.63 47.63,48.63 41.63,46.63 51.01,72.85 48.51,73.81 40.71,21.84 40.77,17.24 40.71,13.67 40.63,41.65 9.63,13.63 59,72.52 59,67.54 70.86,68.22 68.73,63.73 64.33,59.03 66.36,68.52 11.63,18.63 21.4,51.76 24.42,51.73 27.55,51.71 51.6,76.25 51.56,77.28 52.55,77.28 21.43,46.43 50.07,59.22 47.63,59.22 48.65,43.63 48.65,38.63 48.65,33.63 48.65,28.09 10.72,23.32 21.63,16.74 58.78,13.22 66.22,77.77
  pour Bottom: -3.97,-0.96 83.22,-0.96 83.22,84.23 -3.97,84.23
  pour Top: -3.97,-0.96 83.22,-0.96 83.22,84.23 -3.97,84.23
GPS_RX
  Top 0.508: GPS1.RX 46.58,54.21 48.08,55.7 51.76,55.7 U$3.20-A6/TX5/LRCLK1
  Top 0.813: U$3.20-A6/TX5/LRCLK1 J1.8
GPX_TX
  Top 0.508: GPS1.TX 44.04,56.58 45.98,58.51 51.49,58.51 U$3.21-A7/RX5/BCLK1
  Top 0.813: U$3.21-A7/RX5/BCLK1 J1.7
LED1  (via drill 0.35)
  Top 0.305: LED1.A 27.56,71.7
  Top 0.508: v29.63,69.63 29.22,69.63 LED1.A
  Top 0.813: U$3.0-RX1/CS1/CRX2/PWM00 J2.24
  Bottom 0.813: v29.63,69.63 30.63,69.63 31.63,68.63 33.76,68.63 J2.24
LED2  (via drill 0.35)
  Top 0.508: v29.63,65.63 28.12,65.63 LED2.A
  Top 0.813: U$3.1-TX1/MISO1/CTX2/PWM01 J2.23
  Bottom 0.813: v29.63,65.63 29.84,65.85 J2.23
N$1
  Top 0.813: U$3.23-A9/CRX1/MCLK1/PWM23 J1.5
N$2
  Top 0.813: U$3.22-A8/CTX1/PWM22 J1.6
N$3
  Top 0.813: U$3.18-A4/SDA0/PWM18 J1.10
N$4
  Top 0.813: U$3.15-A1/RX3/SPDIF_IN/PWM15 J1.13
N$5
  Top 0.813: J3.12 J4.12
N$6
  Top 0.813: J2.2 U$3.32-OUT1B
N$7
  Top 0.813: U$3.14-A0/TX3/SPDIF_OUT/PWM14 J1.14
N$8
  Top 0.813: U$3.13-SCK/LED/PWM13 J1.15
N$9
  Top 0.813: U$3.41-A17/MISO1 J1.17
N$10
  Top 0.813: U$3.40-A16/CS1 J1.18
N$11
  Top 0.813: U$3.39-A15/CS/OUT1A J1.19
N$12
  Top 0.813: U$3.38-A14/CS/IN1 J1.20
N$13
  Top 0.813: U$3.37-CS/PWM37 J1.21
N$14
  Top 0.813: U$3.36-CS/PWM36 J1.22
N$15
  Top 0.813: U$3.35-TX8 J1.23
N$16
  Top 0.813: U$3.34-RX8 J1.24
N$17
  Top 0.813: J3.11 J4.11
N$18
  Top 0.813: J3.10 J4.10
N$19
  Top 0.813: U$3.19-A5/SCL0/PWM19 J1.9
N$20
  Top 0.813: U$3.3-LRCLK2/PWM03 J2.21
N$21
  Top 0.813: U$3.4-BCLK2/PWM04 J2.20
N$22
  Top 0.813: U$3.5-IN2/PWM05 J2.19
N$23
  Top 0.813: U$3.11-MOSI/CTX1/PWM11 J2.13
N$24
  Top 0.813: U$3.12-MISO/MQSL/PWM12 J2.12
N$25
  Top 0.813: J3.9 J4.9
N$26
  Top 0.813: U$3.26-A12/MOSI1 J2.8
N$27
  Top 0.813: J3.8 J4.8
N$29
  Top 0.813: J3.7 J4.7
N$30
  Top 0.813: J3.6 J4.6
N$31
  Top 0.813: J3.5 J4.5
N$33
  Top 0.305: 24.99,71.64 LED1.C
  Top 0.508: LED1.C 21.79,71.7 R16.1
N$34
  Top 0.813: J3.4 J4.4
N$35
  Top 0.813: J3.3 J4.3
N$36
  Top 0.813: J3.2 J4.2
N$37
  Top 0.813: J3.1 J4.1
N$38
  Top 0.813: J5.12 J6.12
N$39
  Top 0.813: J5.11 J6.11
N$40
  Top 0.813: J5.10 J6.10
N$41
  Top 0.813: J5.9 J6.9
N$42
  Top 2.54: S6.3 64,70.55 63.37,71.17 F1.2
N$43
  Top 1.27: SSM3J372R,LF.3 55.99,74.9 56.87,74.9
  Top 2.54: F1.1 58.14,76.18 56.87,74.9 56.85,74.88
N$44
  Top 1.016: SSM3J372R,LF.2 52.66,73.91 52.63,73.94
  Top 1.27: PS1.VIN 42.17,75 43.8,76.63 47.63,76.63 50.32,73.94 52.63,73.94
N$45
  Top 0.813: J5.8 J6.8
N$46
  Top 0.813: J5.7 J6.7
N$47
  Top 0.813: J5.6 J6.6
N$48
  Top 0.813: J5.5 J6.5
N$49
  Top 0.813: J5.4 J6.4
N$50
  Top 0.813: J5.3 J6.3
N$51
  Top 0.813: J5.2 J6.2
N$52
  Top 0.813: J5.1 J6.1
N$54
  Top 0.508: LED2.C 25.03,66.62 R17.1
N$55
  Top 0.508: LED3.C 25.03,76.62 R15.1
OLED_SCL
  Top 0.305: 33.88,32.83 33.55,33.16
  Top 0.508: U$1.SCL 15.18,34.37 16.39,33.16 33.55,33.16
  Top 0.813: U$3.24-A10/TX6/SCL2/PWM24 J2.10 33.88,32.83
OLED_SDA
  Top 0.508: U$1.SDA 12.64,33.81 15.58,30.87 32.15,30.87 32.73,30.29 J2.9
  Top 0.813: U$3.25-A11/RX6/SDA2/PWM25 J2.9
PSU_EN  (1 unrouted)
  Top 0.305: U$3.2-OUT2/PWM02 36.5,63.26
  Top 0.813: 36.5,63.26 34.05,63.26 J2.22
RF_AUX
  Top 0.508: RF1.AUX 15.86,45.86 20.63,50.63 28.63,50.63 31.14,53.15 J2.18
  Top 0.813: U$3.6-OUT1D/PWM06 J2.18
RF_MODE0
  Top 0.508: RF1.M0 33.77,42.76 J2.14
  Top 0.813: U$3.10-CS\MQSR/PWM10 J2.14
RF_MODE1
  Top 0.508: RF1.M1 23.48,43.57 24.63,44.72 32.26,44.72 33.06,45.53 J2.15
  Top 0.813: U$3.9-OUT1C/PWM09 J2.15
RF_RX
  Top 0.508: RF1.RX 20.94,44.14 23.53,46.73 32.24,46.73 33.57,48.07 J2.16
  Top 0.813: U$3.8-TX2/IN1/PWM08 J2.16
RF_TX
  Top 0.508: RF1.TX 18.4,44.4 22.63,48.63 29.63,48.63 31.6,50.61 J2.17
  Top 0.813: U$3.7-RX2/OUT1A/PWM07 J2.17
VBATT
  Top 2.54: CON1.+ 62.71,61.57 68.69,67.55 S6.2

### Text on the board
tNames: 470 | 5V | ON | 330 | 0 | 330 | 1 | BASE STATION GPS TRACKER | V1.0 MICHAEL VENZ | OLED_LCD | 25 | 24 | 3V3 | - | 10k | 10k | 30 | 29 | 27 | 28 | 10k | 10k | 10k | 31
bNames: E22_900T22DC | - | 5V | VBAT | 2 | + | MPM3610 | - | 21 | 20 | 3V3 | - | - | 5V | 6 | 7 | 8 | 9 | 10 | GY271_COMPASS